# Altium project Goldstrike1_Rev01.PrjPCB (part 2 of 4)

## Sheet GS_01_Core.SchDoc: Title
size A3; Date: Date; CompanyName: Integrated Micro-Electronics Bulgaria; Organization: Design & Development Department; Address1: Drawing Type; Address2: Address 1; Address3: Address 2; Address4: Address 3; DocumentNumber: 730xxx; Revision: 01; SheetNumber: 1; SheetTotal: 1; PageSetup: Record=PageOptions|CenterHorizontal=True|CenterVertical=True|PrintScale=0.70|XCorrection=1.00|YCorrection=1.00|PrintKind=2|BorderSize=5000000|LeftOffset=0|BottomOffset=0|Orientation=2|PaperLength=1000|PaperWidth=1000|Scale=100|PaperSource=7|PrintQuality=-4|MediaType=1|DitherType=10|PaperKind=A4|PrintScaleMode=1; SheetSize: A3; Time: Time; ModifiedDate: Mod. Date
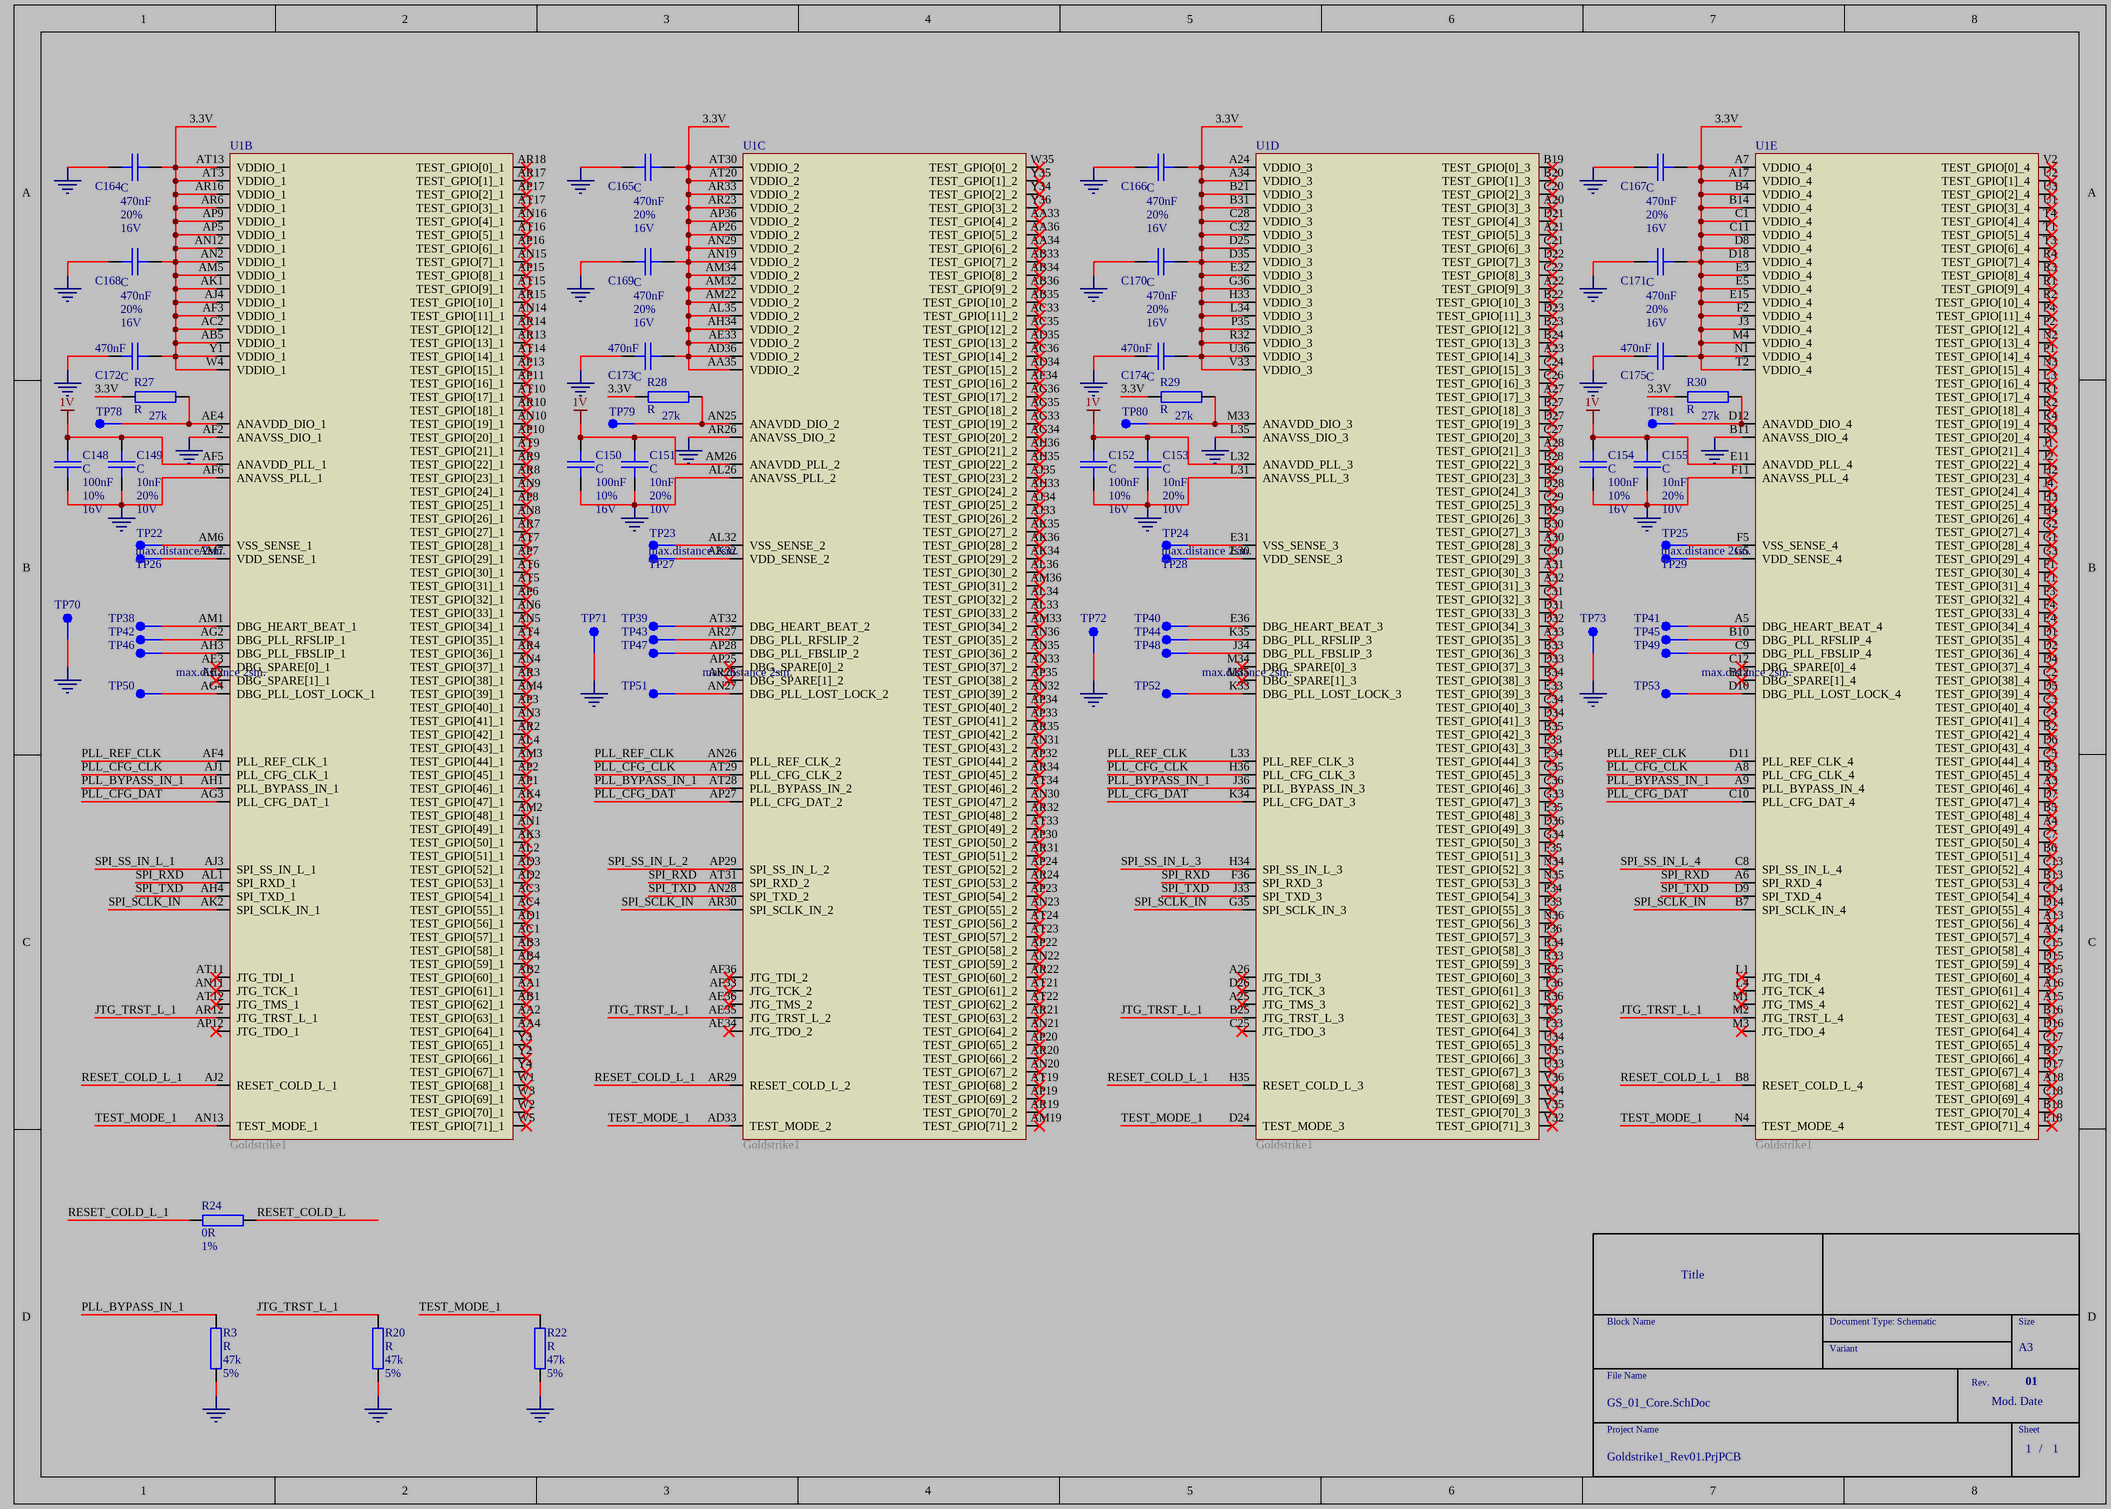
[diagram p2: GS_01_Core.SchDoc]

### Parts
C148  C  DB_VALUE: 100nF  DB_TOLERANCE: 10%  DB_VOLTAGE: 16V  [SMD_0603_CAPC1608X95N]
C149  C  DB_VALUE: 10nF  DB_TOLERANCE: 20%  DB_VOLTAGE: 10V  [SMD_0603_CAPC1608X95N]
C150  C  DB_VALUE: 100nF  DB_TOLERANCE: 10%  DB_VOLTAGE: 16V  [SMD_0603_CAPC1608X95N]
C151  C  DB_VALUE: 10nF  DB_TOLERANCE: 20%  DB_VOLTAGE: 10V  [SMD_0603_CAPC1608X95N]
C152  C  DB_VALUE: 100nF  DB_TOLERANCE: 10%  DB_VOLTAGE: 16V  [SMD_0603_CAPC1608X95N]
C153  C  DB_VALUE: 10nF  DB_TOLERANCE: 20%  DB_VOLTAGE: 10V  [SMD_0603_CAPC1608X95N]
C154  C  DB_VALUE: 100nF  DB_TOLERANCE: 10%  DB_VOLTAGE: 16V  [SMD_0603_CAPC1608X95N]
C155  C  DB_VALUE: 10nF  DB_TOLERANCE: 20%  DB_VOLTAGE: 10V  [SMD_0603_CAPC1608X95N]
C164  C  DB_VALUE: 470nF  DB_TOLERANCE: 20%  DB_VOLTAGE: 16V  [SMD_0603_CAPC1608X95N]
C165  C  DB_VALUE: 470nF  DB_TOLERANCE: 20%  DB_VOLTAGE: 16V  [SMD_0603_CAPC1608X95N]
C166  C  DB_VALUE: 470nF  DB_TOLERANCE: 20%  DB_VOLTAGE: 16V  [SMD_0603_CAPC1608X95N]
C167  C  DB_VALUE: 470nF  DB_TOLERANCE: 20%  DB_VOLTAGE: 16V  [SMD_0603_CAPC1608X95N]
C168  C  DB_VALUE: 470nF  DB_TOLERANCE: 20%  DB_VOLTAGE: 16V  [SMD_0603_CAPC1608X95N]
C169  C  DB_VALUE: 470nF  DB_TOLERANCE: 20%  DB_VOLTAGE: 16V  [SMD_0603_CAPC1608X95N]
C170  C  DB_VALUE: 470nF  DB_TOLERANCE: 20%  DB_VOLTAGE: 16V  [SMD_0603_CAPC1608X95N]
C171  C  DB_VALUE: 470nF  DB_TOLERANCE: 20%  DB_VOLTAGE: 16V  [SMD_0603_CAPC1608X95N]
C172  C  DB_VALUE: 470nF  [SMD_0603_CAPC1608X95N]
C173  C  DB_VALUE: 470nF  [SMD_0603_CAPC1608X95N]
C174  C  DB_VALUE: 470nF  [SMD_0603_CAPC1608X95N]
C175  C  DB_VALUE: 470nF  [SMD_0603_CAPC1608X95N]
R3  R  DB_VALUE: 47k  DB_TOLERANCE: 5%  [SMD_0603_RESC1608X55N]
R20  R  DB_VALUE: 47k  DB_TOLERANCE: 5%  [SMD_0603_RESC1608X55N]
R22  R  DB_VALUE: 47k  DB_TOLERANCE: 5%  [SMD_0603_RESC1608X55N]
R24  DB_VALUE: 0R  DB_TOLERANCE: 1%  [SMD_0603_RESC1608X55N]  (hidden comment: R)
R27  R  DB_VALUE: 27k  [SMD_0603_RESC1608X55N]
R28  R  DB_VALUE: 27k  [SMD_0603_RESC1608X55N]
R29  R  DB_VALUE: 27k  [SMD_0603_RESC1608X55N]
R30  R  DB_VALUE: 27k  [SMD_0603_RESC1608X55N]
TP22  TEST_POINT_1  [SMD_TP_100-254]  (value not drawn)
TP23  TEST_POINT_1  [SMD_TP_100-254]  (value not drawn)
TP24  TEST_POINT_1  [SMD_TP_100-254]  (value not drawn)
TP25  TEST_POINT_1  [SMD_TP_100-254]  (value not drawn)
TP26  TEST_POINT_1  [SMD_TP_100-254]  (value not drawn)
TP27  TEST_POINT_1  [SMD_TP_100-254]  (value not drawn)
TP28  TEST_POINT_1  [SMD_TP_100-254]  (value not drawn)
TP29  TEST_POINT_1  [SMD_TP_100-254]  (value not drawn)
TP38  TEST_POINT_1  [SMD_TP_100-254]  (value not drawn)
TP39  TEST_POINT_1  [SMD_TP_100-254]  (value not drawn)
TP40  TEST_POINT_1  [SMD_TP_100-254]  (value not drawn)
TP41  TEST_POINT_1  [SMD_TP_100-254]  (value not drawn)
TP42  TEST_POINT_1  [SMD_TP_100-254]  (value not drawn)
TP43  TEST_POINT_1  [SMD_TP_100-254]  (value not drawn)
TP44  TEST_POINT_1  [SMD_TP_100-254]  (value not drawn)
TP45  TEST_POINT_1  [SMD_TP_100-254]  (value not drawn)
TP46  TEST_POINT_1  [SMD_TP_100-254]  (value not drawn)
TP47  TEST_POINT_1  [SMD_TP_100-254]  (value not drawn)
TP48  TEST_POINT_1  [SMD_TP_100-254]  (value not drawn)
TP49  TEST_POINT_1  [SMD_TP_100-254]  (value not drawn)
TP50  TEST_POINT_1  [SMD_TP_100-254]  (value not drawn)
TP51  TEST_POINT_1  [SMD_TP_100-254]  (value not drawn)
TP52  TEST_POINT_1  [SMD_TP_100-254]  (value not drawn)
TP53  TEST_POINT_1  [SMD_TP_100-254]  (value not drawn)
TP70  TEST_POINT_1  [SMD_TP_100-254]  (value not drawn)
TP71  TEST_POINT_1  [SMD_TP_100-254]  (value not drawn)
TP72  TEST_POINT_1  [SMD_TP_100-254]  (value not drawn)
TP73  TEST_POINT_1  [SMD_TP_100-254]  (value not drawn)
TP78  TEST_POINT_1  [SMD_TP_100-254]  (value not drawn)
TP79  TEST_POINT_1  [SMD_TP_100-254]  (value not drawn)
TP80  TEST_POINT_1  [SMD_TP_100-254]  (value not drawn)
TP81  TEST_POINT_1  [SMD_TP_100-254]  (value not drawn)
U1  Goldstrike1  (parts B,C,D,E of 5)

### Nets
1V: C148.1 C149.1 C150.1 C151.1 C152.1 C153.1 C154.1 C155.1 U1.AF5(ANAVDD_PLL_1) U1.AM26(ANAVDD_PLL_2) U1.E11(ANAVDD_PLL_4) U1.L32(ANAVDD_PLL_3)
GND: C148.2 C149.2 C150.2 C151.2 C152.2 C153.2 C154.2 C155.2 C164.1 C165.1 C166.1 C167.1 C168.1 C169.1 C170.1 C171.1 C172.1 C173.1 C174.1 C175.1 R3.2 R20.2 R22.2 TP70.1 TP71.1 TP72.1 TP73.1 U1.AF2(ANAVSS_DIO_1) U1.AF6(ANAVSS_PLL_1) U1.AL26(ANAVSS_PLL_2) U1.AR26(ANAVSS_DIO_2) U1.B11(ANAVSS_DIO_4) U1.F11(ANAVSS_PLL_4) U1.L31(ANAVSS_PLL_3) U1.L35(ANAVSS_DIO_3)
3.3V: C164.2 C165.2 C166.2 C167.2 C168.2 C169.2 C170.2 C171.2 C172.2 C173.2 C174.2 C175.2 R27.1 R28.1 R29.1 R30.1 U1.A7(VDDIO_4) U1.A17(VDDIO_4) U1.A24(VDDIO_3) U1.A34(VDDIO_3) U1.AA35(VDDIO_2) U1.AB5(VDDIO_1) U1.AC2(VDDIO_1) U1.AD36(VDDIO_2) U1.AE33(VDDIO_2) U1.AF3(VDDIO_1) U1.AH34(VDDIO_2) U1.AJ4(VDDIO_1) U1.AK1(VDDIO_1) U1.AL35(VDDIO_2) U1.AM5(VDDIO_1) U1.AM22(VDDIO_2) U1.AM32(VDDIO_2) U1.AM34(VDDIO_2) U1.AN2(VDDIO_1) U1.AN12(VDDIO_1) U1.AN19(VDDIO_2) U1.AN29(VDDIO_2) U1.AP5(VDDIO_1) U1.AP9(VDDIO_1) U1.AP26(VDDIO_2) U1.AP36(VDDIO_2) U1.AR6(VDDIO_1) U1.AR16(VDDIO_1) U1.AR23(VDDIO_2) U1.AR33(VDDIO_2) U1.AT3(VDDIO_1) U1.AT13(VDDIO_1) U1.AT20(VDDIO_2) U1.AT30(VDDIO_2) U1.B4(VDDIO_4) U1.B14(VDDIO_4) U1.B21(VDDIO_3) U1.B31(VDDIO_3) U1.C1(VDDIO_4) U1.C11(VDDIO_4) U1.C28(VDDIO_3) U1.C32(VDDIO_3) U1.D8(VDDIO_4) U1.D18(VDDIO_4) U1.D25(VDDIO_3) U1.D35(VDDIO_3) U1.E3(VDDIO_4) U1.E5(VDDIO_4) U1.E15(VDDIO_4) U1.E32(VDDIO_3) U1.F2(VDDIO_4) U1.G36(VDDIO_3) U1.H33(VDDIO_3) U1.J3(VDDIO_4) U1.L34(VDDIO_3) U1.M4(VDDIO_4) U1.N1(VDDIO_4) U1.P35(VDDIO_3) U1.R32(VDDIO_3) U1.T2(VDDIO_4) U1.U36(VDDIO_3) U1.V33(VDDIO_3) U1.W4(VDDIO_1) U1.Y1(VDDIO_1)
JTG_TRST_L_1: R20.1 U1.AE35(JTG_TRST_L_2) U1.AR12(JTG_TRST_L_1) U1.B25(JTG_TRST_L_3) U1.M2(JTG_TRST_L_4)
PLL_BYPASS_IN_1: R3.1 U1.A9(PLL_BYPASS_IN_4) U1.AH1(PLL_BYPASS_IN_1) U1.AT28(PLL_BYPASS_IN_2) U1.J36(PLL_BYPASS_IN_3)
PLL_CFG_CLK: U1.A8(PLL_CFG_CLK_4) U1.AJ1(PLL_CFG_CLK_1) U1.AT29(PLL_CFG_CLK_2) U1.H36(PLL_CFG_CLK_3)
PLL_CFG_DAT: U1.AG3(PLL_CFG_DAT_1) U1.AP27(PLL_CFG_DAT_2) U1.C10(PLL_CFG_DAT_4) U1.K34(PLL_CFG_DAT_3)
PLL_REF_CLK: U1.AF4(PLL_REF_CLK_1) U1.AN26(PLL_REF_CLK_2) U1.D11(PLL_REF_CLK_4) U1.L33(PLL_REF_CLK_3)
RESET_COLD_L: R24.1
RESET_COLD_L_1: R24.2 U1.AJ2(RESET_COLD_L_1) U1.AR29(RESET_COLD_L_2) U1.B8(RESET_COLD_L_4) U1.H35(RESET_COLD_L_3)
SPI_RXD: U1.A6(SPI_RXD_4) U1.AL1(SPI_RXD_1) U1.AT31(SPI_RXD_2) U1.F36(SPI_RXD_3)
SPI_SCLK_IN: U1.AK2(SPI_SCLK_IN_1) U1.AR30(SPI_SCLK_IN_2) U1.B7(SPI_SCLK_IN_4) U1.G35(SPI_SCLK_IN_3)
SPI_SS_IN_L_1: U1.AJ3(SPI_SS_IN_L_1)
SPI_SS_IN_L_2: U1.AP29(SPI_SS_IN_L_2)
SPI_SS_IN_L_3: U1.H34(SPI_SS_IN_L_3)
SPI_SS_IN_L_4: U1.C8(SPI_SS_IN_L_4)
SPI_TXD: U1.AH4(SPI_TXD_1) U1.AN28(SPI_TXD_2) U1.D9(SPI_TXD_4) U1.J33(SPI_TXD_3)
TEST_MODE_1: R22.1 U1.AD33(TEST_MODE_2) U1.AN13(TEST_MODE_1) U1.D24(TEST_MODE_3) U1.N4(TEST_MODE_4)
NetR27_2: R27.2 TP78.1 U1.AE4(ANAVDD_DIO_1)
NetR28_2: R28.2 TP79.1 U1.AN25(ANAVDD_DIO_2)
NetR29_2: R29.2 TP80.1 U1.M33(ANAVDD_DIO_3)
NetR30_2: R30.2 TP81.1 U1.D12(ANAVDD_DIO_4)
NetTP22_1: TP22.1 U1.AM6(VSS_SENSE_1)
NetTP23_1: TP23.1 U1.AL32(VSS_SENSE_2)
NetTP24_1: TP24.1 U1.E31(VSS_SENSE_3)
NetTP25_1: TP25.1 U1.F5(VSS_SENSE_4)
NetTP26_1: TP26.1 U1.AM7(VDD_SENSE_1)
NetTP27_1: TP27.1 U1.AK32(VDD_SENSE_2)
NetTP28_1: TP28.1 U1.E30(VDD_SENSE_3)
NetTP29_1: TP29.1 U1.G5(VDD_SENSE_4)
NetTP38_1: TP38.1 U1.AM1(DBG_HEART_BEAT_1)
NetTP39_1: TP39.1 U1.AT32(DBG_HEART_BEAT_2)
NetTP40_1: TP40.1 U1.E36(DBG_HEART_BEAT_3)
NetTP41_1: TP41.1 U1.A5(DBG_HEART_BEAT_4)
NetTP42_1: TP42.1 U1.AG2(DBG_PLL_RFSLIP_1)
NetTP43_1: TP43.1 U1.AR27(DBG_PLL_RFSLIP_2)
NetTP44_1: TP44.1 U1.K35(DBG_PLL_RFSLIP_3)
NetTP45_1: TP45.1 U1.B10(DBG_PLL_RFSLIP_4)
NetTP46_1: TP46.1 U1.AH3(DBG_PLL_FBSLIP_1)
NetTP47_1: TP47.1 U1.AP28(DBG_PLL_FBSLIP_2)
NetTP48_1: TP48.1 U1.J34(DBG_PLL_FBSLIP_3)
NetTP49_1: TP49.1 U1.C9(DBG_PLL_FBSLIP_4)
NetTP50_1: TP50.1 U1.AG4(DBG_PLL_LOST_LOCK_1)
NetTP51_1: TP51.1 U1.AN27(DBG_PLL_LOST_LOCK_2)
NetTP52_1: TP52.1 U1.K33(DBG_PLL_LOST_LOCK_3)
NetTP53_1: TP53.1 U1.D10(DBG_PLL_LOST_LOCK_4)

Not connected (* = marked no-connect by the designer): U1 A3(TEST_GPIO[46]_4)* A4(TEST_GPIO[49]_4)* A13(TEST_GPIO[56]_4)* A14(TEST_GPIO[57]_4)* A15(TEST_GPIO[62]_4)* A16(TEST_GPIO[61]_4)* A18(TEST_GPIO[68]_4)* A20(TEST_GPIO[3]_3)* A21(TEST_GPIO[5]_3)* A22(TEST_GPIO[9]_3)* A23(TEST_GPIO[14]_3)* A25(JTG_TMS_3)* A26(JTG_TDI_3)* A27(TEST_GPIO[17]_3)* A28(TEST_GPIO[21]_3)* A30(TEST_GPIO[28]_3)* A31(TEST_GPIO[30]_3)* A32(TEST_GPIO[31]_3)* A33(TEST_GPIO[35]_3)* AA1(TEST_GPIO[61]_1)* AA2(TEST_GPIO[63]_1)* AA4(TEST_GPIO[64]_1)* AA33(TEST_GPIO[4]_2)* AA34(TEST_GPIO[6]_2)* AA36(TEST_GPIO[5]_2)* AB1(TEST_GPIO[62]_1)* AB2(TEST_GPIO[60]_1)* AB3(TEST_GPIO[58]_1)* AB4(TEST_GPIO[59]_1)* AB33(TEST_GPIO[7]_2)* AB34(TEST_GPIO[8]_2)* AB35(TEST_GPIO[10]_2)* AB36(TEST_GPIO[9]_2)* AC1(TEST_GPIO[57]_1)* AC3(TEST_GPIO[54]_1)* AC4(TEST_GPIO[55]_1)* AC33(TEST_GPIO[11]_2)* AC35(TEST_GPIO[12]_2)* AC36(TEST_GPIO[14]_2)* AD1(TEST_GPIO[56]_1)* AD2(TEST_GPIO[53]_1)* AD3(TEST_GPIO[52]_1)* AD34(TEST_GPIO[15]_2)* AD35(TEST_GPIO[13]_2)* AE2(DBG_SPARE[1]_1)* AE3(DBG_SPARE[0]_1)* AE34(JTG_TDO_2)* AE36(JTG_TMS_2)* AF33(JTG_TCK_2)* AF34(TEST_GPIO[16]_2)* AF36(JTG_TDI_2)* AG33(TEST_GPIO[19]_2)* AG34(TEST_GPIO[20]_2)* AG35(TEST_GPIO[18]_2)* AG36(TEST_GPIO[17]_2)* AH33(TEST_GPIO[24]_2)* AH35(TEST_GPIO[22]_2)* AH36(TEST_GPIO[21]_2)* AJ33(TEST_GPIO[26]_2)* AJ34(TEST_GPIO[25]_2)* AJ35(TEST_GPIO[23]_2)* AK3(TEST_GPIO[50]_1)* AK4(TEST_GPIO[47]_1)* AK34(TEST_GPIO[29]_2)* AK35(TEST_GPIO[27]_2)* AK36(TEST_GPIO[28]_2)* AL2(TEST_GPIO[51]_1)* AL4(TEST_GPIO[43]_1)* AL33(TEST_GPIO[33]_2)* AL34(TEST_GPIO[32]_2)* AL36(TEST_GPIO[30]_2)* AM2(TEST_GPIO[48]_1)* AM3(TEST_GPIO[44]_1)* AM4(TEST_GPIO[39]_1)* AM19(TEST_GPIO[71]_2)* AM33(TEST_GPIO[34]_2)* AM36(TEST_GPIO[31]_2)* AN1(TEST_GPIO[49]_1)* AN3(TEST_GPIO[41]_1)* AN4(TEST_GPIO[37]_1)* AN5(TEST_GPIO[34]_1)* AN6(TEST_GPIO[33]_1)* AN8(TEST_GPIO[26]_1)* AN9(TEST_GPIO[24]_1)* AN10(TEST_GPIO[19]_1)* AN11(JTG_TCK_1)* AN14(TEST_GPIO[11]_1)* AN15(TEST_GPIO[7]_1)* AN16(TEST_GPIO[4]_1)* AN20(TEST_GPIO[67]_2)* AN21(TEST_GPIO[64]_2)* AN22(TEST_GPIO[59]_2)* AN23(TEST_GPIO[55]_2)* AN30(TEST_GPIO[47]_2)* AN31(TEST_GPIO[43]_2)* AN32(TEST_GPIO[39]_2)* AN33(TEST_GPIO[37]_2)* AN35(TEST_GPIO[36]_2)* AN36(TEST_GPIO[35]_2)* AP1(TEST_GPIO[46]_1)* AP2(TEST_GPIO[45]_1)* AP3(TEST_GPIO[40]_1)* AP6(TEST_GPIO[32]_1)* AP7(TEST_GPIO[29]_1)* AP8(TEST_GPIO[25]_1)* AP10(TEST_GPIO[20]_1)* AP11(TEST_GPIO[16]_1)* AP12(JTG_TDO_1)* AP13(TEST_GPIO[15]_1)* AP15(TEST_GPIO[8]_1)* AP16(TEST_GPIO[6]_1)* AP17(TEST_GPIO[2]_1)* AP19(TEST_GPIO[69]_2)* AP20(TEST_GPIO[65]_2)* AP22(TEST_GPIO[58]_2)* AP23(TEST_GPIO[54]_2)* AP24(TEST_GPIO[52]_2)* AP25(DBG_SPARE[0]_2)* AP30(TEST_GPIO[50]_2)* AP32(TEST_GPIO[44]_2)* AP33(TEST_GPIO[41]_2)* AP34(TEST_GPIO[40]_2)* AP35(TEST_GPIO[38]_2)* AR2(TEST_GPIO[42]_1)* AR3(TEST_GPIO[38]_1)* AR4(TEST_GPIO[36]_1)* AR7(TEST_GPIO[27]_1)* AR8(TEST_GPIO[23]_1)* AR9(TEST_GPIO[22]_1)* AR10(TEST_GPIO[18]_1)* AR13(TEST_GPIO[13]_1)* AR14(TEST_GPIO[12]_1)* AR15(TEST_GPIO[10]_1)* AR17(TEST_GPIO[1]_1)* AR18(TEST_GPIO[0]_1)* AR19(TEST_GPIO[70]_2)* AR20(TEST_GPIO[66]_2)* AR21(TEST_GPIO[63]_2)* AR22(TEST_GPIO[60]_2)* AR24(TEST_GPIO[53]_2)* AR25(DBG_SPARE[1]_2)* AR31(TEST_GPIO[51]_2)* AR32(TEST_GPIO[48]_2)* AR34(TEST_GPIO[45]_2)* AR35(TEST_GPIO[42]_2)* AT4(TEST_GPIO[35]_1)* AT5(TEST_GPIO[31]_1)* AT6(TEST_GPIO[30]_1)* AT7(TEST_GPIO[28]_1)* AT9(TEST_GPIO[21]_1)* AT10(TEST_GPIO[17]_1)* AT11(JTG_TDI_1)* AT12(JTG_TMS_1)* AT14(TEST_GPIO[14]_1)* AT15(TEST_GPIO[9]_1)* AT16(TEST_GPIO[5]_1)* AT17(TEST_GPIO[3]_1)* AT19(TEST_GPIO[68]_2)* AT21(TEST_GPIO[61]_2)* AT22(TEST_GPIO[62]_2)* AT23(TEST_GPIO[57]_2)* AT24(TEST_GPIO[56]_2)* AT33(TEST_GPIO[49]_2)* AT34(TEST_GPIO[46]_2)* B2(TEST_GPIO[42]_4)* B3(TEST_GPIO[45]_4)* B5(TEST_GPIO[48]_4)* B6(TEST_GPIO[51]_4)* B12(DBG_SPARE[1]_4)* B13(TEST_GPIO[53]_4)* B15(TEST_GPIO[60]_4)* B16(TEST_GPIO[63]_4)* B17(TEST_GPIO[66]_4)* B18(TEST_GPIO[70]_4)* B19(TEST_GPIO[0]_3)* B20(TEST_GPIO[1]_3)* B22(TEST_GPIO[10]_3)* B23(TEST_GPIO[12]_3)* B24(TEST_GPIO[13]_3)* B27(TEST_GPIO[18]_3)* B28(TEST_GPIO[22]_3)* B29(TEST_GPIO[23]_3)* B30(TEST_GPIO[27]_3)* B33(TEST_GPIO[36]_3)* B34(TEST_GPIO[38]_3)* B35(TEST_GPIO[42]_3)* C2(TEST_GPIO[38]_4)* C3(TEST_GPIO[40]_4)* C4(TEST_GPIO[41]_4)* C5(TEST_GPIO[44]_4)* C7(TEST_GPIO[50]_4)* C12(DBG_SPARE[0]_4)* C13(TEST_GPIO[52]_4)* C14(TEST_GPIO[54]_4)* C15(TEST_GPIO[58]_4)* C17(TEST_GPIO[65]_4)* C18(TEST_GPIO[69]_4)* C20(TEST_GPIO[2]_3)* C21(TEST_GPIO[6]_3)* C22(TEST_GPIO[8]_3)* C24(TEST_GPIO[15]_3)* C25(JTG_TDO_3)* C26(TEST_GPIO[16]_3)* C27(TEST_GPIO[20]_3)* C29(TEST_GPIO[25]_3)* C30(TEST_GPIO[29]_3)* C31(TEST_GPIO[32]_3)* C34(TEST_GPIO[40]_3)* C35(TEST_GPIO[45]_3)* C36(TEST_GPIO[46]_3)* D1(TEST_GPIO[35]_4)* D2(TEST_GPIO[36]_4)* D4(TEST_GPIO[37]_4)* D5(TEST_GPIO[39]_4)* D6(TEST_GPIO[43]_4)* D7(TEST_GPIO[47]_4)* D14(TEST_GPIO[55]_4)* D15(TEST_GPIO[59]_4)* D16(TEST_GPIO[64]_4)* D17(TEST_GPIO[67]_4)* D21(TEST_GPIO[4]_3)* D22(TEST_GPIO[7]_3)* D23(TEST_GPIO[11]_3)* D26(JTG_TCK_3)* D27(TEST_GPIO[19]_3)* D28(TEST_GPIO[24]_3)* D29(TEST_GPIO[26]_3)* D31(TEST_GPIO[33]_3)* D32(TEST_GPIO[34]_3)* D33(TEST_GPIO[37]_3)* D34(TEST_GPIO[41]_3)* D36(TEST_GPIO[49]_3)* E1(TEST_GPIO[31]_4)* E4(TEST_GPIO[34]_4)* E18(TEST_GPIO[71]_4)* E33(TEST_GPIO[39]_3)* E34(TEST_GPIO[44]_3)* E35(TEST_GPIO[48]_3)* F1(TEST_GPIO[30]_4)* F3(TEST_GPIO[32]_4)* F4(TEST_GPIO[33]_4)* F33(TEST_GPIO[43]_3)* F35(TEST_GPIO[51]_3)* G1(TEST_GPIO[28]_4)* G2(TEST_GPIO[27]_4)* G3(TEST_GPIO[29]_4)* G33(TEST_GPIO[47]_3)* G34(TEST_GPIO[50]_3)* H2(TEST_GPIO[23]_4)* H3(TEST_GPIO[25]_4)* H4(TEST_GPIO[26]_4)* J1(TEST_GPIO[21]_4)* J2(TEST_GPIO[22]_4)* J4(TEST_GPIO[24]_4)* K1(TEST_GPIO[17]_4)* K2(TEST_GPIO[18]_4)* K3(TEST_GPIO[20]_4)* K4(TEST_GPIO[19]_4)* L1(JTG_TDI_4)* L3(TEST_GPIO[16]_4)* L4(JTG_TCK_4)* M1(JTG_TMS_4)* M3(JTG_TDO_4)* M34(DBG_SPARE[0]_3)* M35(DBG_SPARE[1]_3)* N2(TEST_GPIO[13]_4)* N3(TEST_GPIO[15]_4)* N34(TEST_GPIO[52]_3)* N35(TEST_GPIO[53]_3)* N36(TEST_GPIO[56]_3)* P1(TEST_GPIO[14]_4)* P2(TEST_GPIO[12]_4)* P4(TEST_GPIO[11]_4)* P33(TEST_GPIO[55]_3)* P34(TEST_GPIO[54]_3)* P36(TEST_GPIO[57]_3)* R1(TEST_GPIO[9]_4)* R2(TEST_GPIO[10]_4)* R3(TEST_GPIO[8]_4)* R4(TEST_GPIO[7]_4)* R33(TEST_GPIO[59]_3)* R34(TEST_GPIO[58]_3)* R35(TEST_GPIO[60]_3)* R36(TEST_GPIO[62]_3)* T1(TEST_GPIO[5]_4)* T3(TEST_GPIO[6]_4)* T4(TEST_GPIO[4]_4)* T33(TEST_GPIO[64]_3)* T35(TEST_GPIO[63]_3)* T36(TEST_GPIO[61]_3)* U1(TEST_GPIO[3]_4)* U2(TEST_GPIO[1]_4)* U3(TEST_GPIO[2]_4)* U33(TEST_GPIO[67]_3)* U34(TEST_GPIO[65]_3)* U35(TEST_GPIO[66]_3)* V2(TEST_GPIO[0]_4)* V32(TEST_GPIO[71]_3)* V34(TEST_GPIO[69]_3)* V35(TEST_GPIO[70]_3)* V36(TEST_GPIO[68]_3)* W1(TEST_GPIO[68]_1)* W2(TEST_GPIO[70]_1)* W3(TEST_GPIO[69]_1)* W5(TEST_GPIO[71]_1)* W35(TEST_GPIO[0]_2)* Y2(TEST_GPIO[66]_1)* Y3(TEST_GPIO[65]_1)* Y4(TEST_GPIO[67]_1)* Y34(TEST_GPIO[2]_2)* Y35(TEST_GPIO[1]_2)* Y36(TEST_GPIO[3]_2)*

### Notes on the sheet
- max.distance 2sm.
- Block Name
- Document Type: Schematic
- Size
- File Name
- Variant
- Rev.
- Project Name
- Sheet
- /

### Library data of the parts
C148 C150 C152 C154 = CAP000047357: NOTE: <NOTE>; DB_PART_NUMBER: CAP000047357
C149 C151 C153 C155 = CAP000038821: NOTE: <NOTE>; DB_PART_NUMBER: CAP000038821
C164-C171 = CAP000023179: DB_PART_TYPE: Ceramic_SMD\Open_Mode_X7R; DB_MANUFACTURER_PART: KEMET    C0603F474M4RAC; NOTE: <NOTE>; DB_T_RANGE: -55 to 125; DB_PACKAGE: 0603; DB_DESCRIPTION: C X7R 470nF 20% 16V 0603; DB_STATUS: NEW; DB_PART_NUMBER: CAP000023179; DB_PCB_DEVICE: SMD_0603_CAPC1608X95N; DB_APPROVED_ON: 09.10.2010; DB_DATASHEET: http://john.epiqdesign.com/projects/CIS_Datasheets/F3102_CE_Kemet.pdf?rev=92&sc=0
C172-C175 = CAP000023179: DB_PART_TYPE: Ceramic_SMD\Open_Mode_X7R; DB_MANUFACTURER_PART: KEMET    C0603F474M4RAC; NOTE: <NOTE>; DB_TOLERANCE: 20%; DB_VOLTAGE: 16V; DB_T_RANGE: -55 to 125; DB_PACKAGE: 0603; DB_DESCRIPTION: C X7R 470nF 20% 16V 0603; DB_STATUS: NEW; DB_PART_NUMBER: CAP000023179; DB_PCB_DEVICE: SMD_0603_CAPC1608X95N; DB_APPROVED_ON: 09.10.2010; DB_DATASHEET: http://john.epiqdesign.com/projects/CIS_Datasheets/F3102_CE_Kemet.pdf?rev=92&sc=0
R3 R20 R22 = RES000006462: DB_PART_TYPE: SMD; DB_MANUFACTURER_PART: YAGEO    RC0603JR-0747K; NOTE: <NOTE>; DB_T_RANGE: -55 to 155; DB_POWER: 1/10W; DB_PACKAGE: 0603; DB_DESCRIPTION: R SMD 47K 5% 1/10W 0603; DB_PRICE: 0.000364; DB_MOQ: 5000; DB_STATUS: NEW; R_BDS: R; DB_PART_NUMBER: RES000006462; DB_PCB_DEVICE: SMD_0603_RESC1608X55N; DB_PRICE_DATE: 2010-12-23; DB_APPROVED_ON: 09.10.2010; DB_DATASHEET: http://john.epiqdesign.com/projects/CIS_Datasheets/PYu-RC0603_51_RoHS_L_4_YAGEO.pdf?rev=138&sc=0
R24 = RES000008926: DB_PART_TYPE: SMD; DB_MANUFACTURER_PART: YAGEO    AC0603FR-070RL; NOTE: <NOTE>; DB_T_RANGE: -55 to 155; DB_POWER: 1/10W; DB_PACKAGE: 0603; DB_DESCRIPTION: R SMD 0R 1% 1/10W 0603; DB_CERTIFIED: AUT; DB_APPROVED_BY: VSN; DB_STATUS: NEW; R_BDS: R; DB_PART_NUMBER: RES000008926; DB_PCB_DEVICE: SMD_0603_RESC1608X55N; DB_APPROVED_ON: 21.05.2013 09:19:53; DB_DATASHEET: http://john.epiqdesign.com/projects/CIS_Datasheets/RES_AC_YAGEO.pdf?rev=263&sc=0
R27-R30 = RES000006456: DB_PART_TYPE: SMD; DB_MANUFACTURER_PART: YAGEO    RC0603JR-0727K; NOTE: <NOTE>; DB_TOLERANCE: 5%; DB_T_RANGE: -55 to 155; DB_POWER: 1/10W; DB_PACKAGE: 0603; DB_DESCRIPTION: R SMD 27K 5% 1/10W 0603; DB_PRICE: 0.000364; DB_MOQ: 5000; DB_STATUS: NEW; R_BDS: R; DB_PART_NUMBER: RES000006456; DB_PCB_DEVICE: SMD_0603_RESC1608X55N; DB_PRICE_DATE: 2010-12-23; DB_APPROVED_ON: 09.10.2010; DB_DATASHEET: http://john.epiqdesign.com/projects/CIS_Datasheets/PYu-RC0603_51_RoHS_L_4_YAGEO.pdf?rev=138&sc=0
TP22-TP29 TP38-TP53 TP70-TP73 TP78-TP81 = TPO000000001: DB_PART_TYPE: Test Point; DB_VALUE: 100_254; DB_DESCRIPTION: Test Point 100_254; DB_STATUS: NEW; DB_PART_NUMBER: TPO000000001; DB_DIAMETER: 100_254; DB_PCB_DEVICE: SMD_TP_100-254; DB_APPROVED_ON: 10.09.2010

## Sheet GS_01_Pow.SchDoc: Title
size A3; Date: Date; CompanyName: Integrated Micro-Electronics Bulgaria; Organization: Design & Development Department; Address1: Drawing Type; Address2: Address 1; Address3: Address 2; Address4: Address 3; DocumentNumber: 730xxx; Revision: 01; SheetNumber: 1; SheetTotal: 1; PageSetup: Record=PageOptions|CenterHorizontal=True|CenterVertical=True|PrintScale=0.70|XCorrection=1.00|YCorrection=1.00|PrintKind=2|BorderSize=5000000|LeftOffset=0|BottomOffset=0|Orientation=2|PaperLength=1000|PaperWidth=1000|Scale=100|PaperSource=7|PrintQuality=-4|MediaType=1|DitherType=10|PaperKind=A4|PrintScaleMode=1; SheetSize: A3; Time: Time; ModifiedDate: Mod. Date
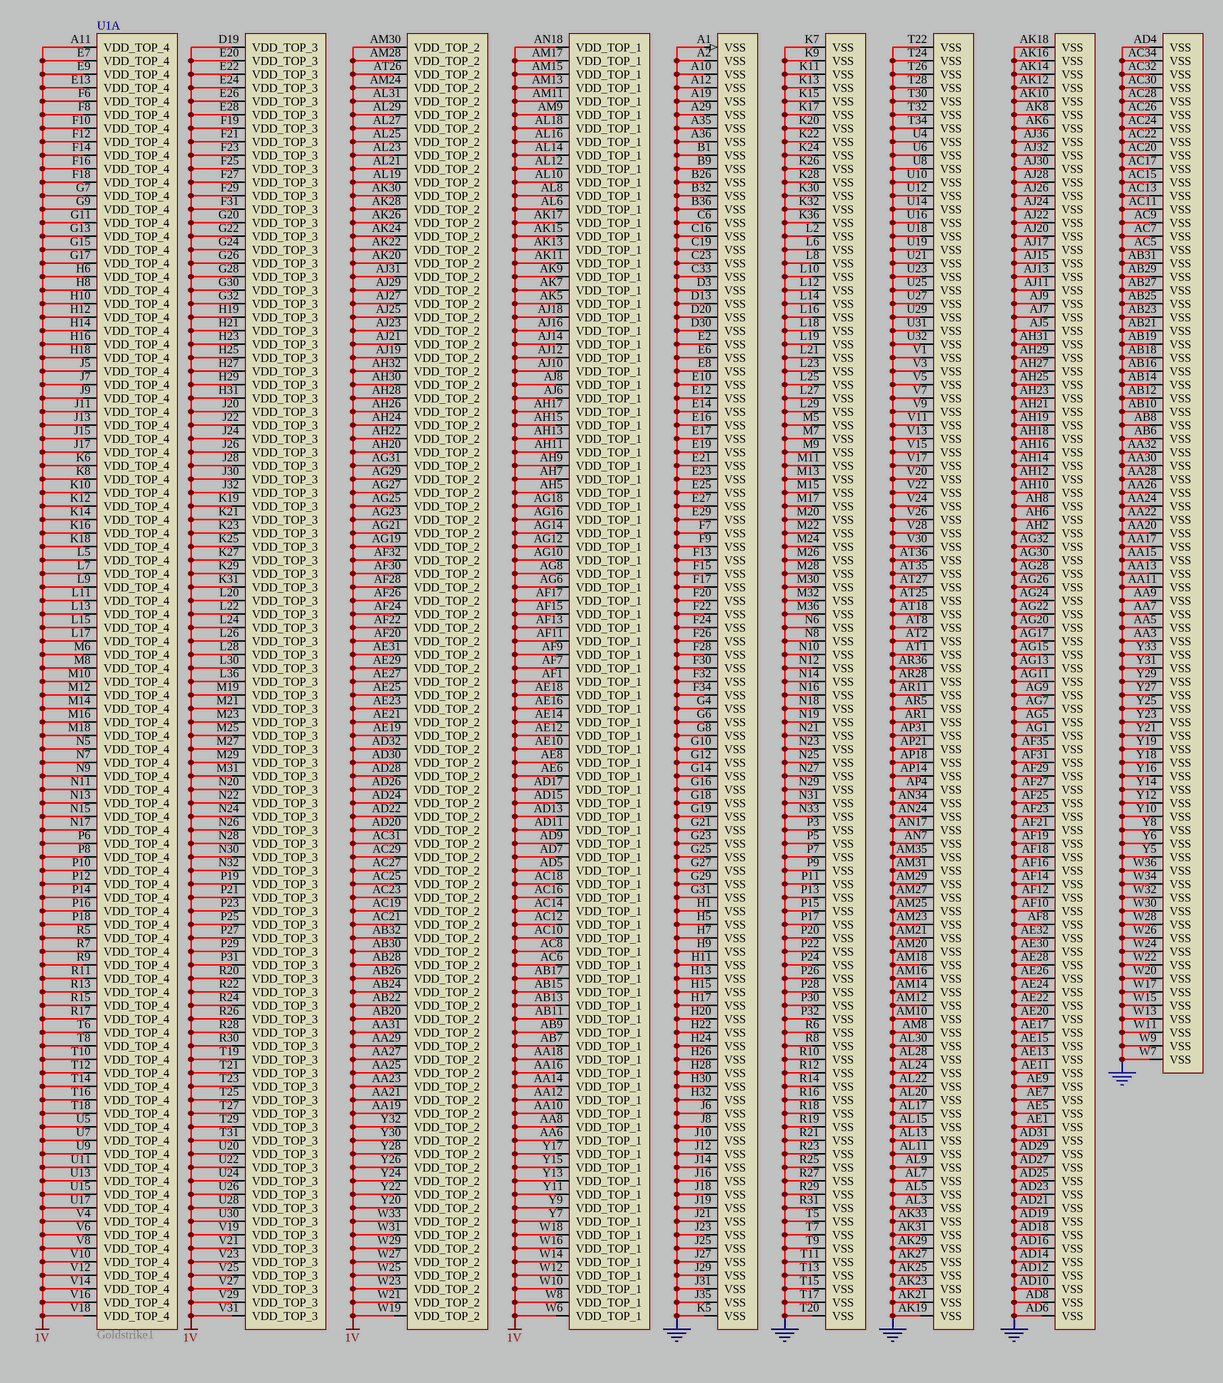
[diagram p3: GS_01_Pow.SchDoc]

### Parts
U1  Goldstrike1  (part A of 5)

### Nets
1V: U1.A11(VDD_TOP_4) U1.AA6(VDD_TOP_1) U1.AA8(VDD_TOP_1) U1.AA10(VDD_TOP_1) U1.AA12(VDD_TOP_1) U1.AA14(VDD_TOP_1) U1.AA16(VDD_TOP_1) U1.AA18(VDD_TOP_1) U1.AA19(VDD_TOP_2) U1.AA21(VDD_TOP_2) U1.AA23(VDD_TOP_2) U1.AA25(VDD_TOP_2) U1.AA27(VDD_TOP_2) U1.AA29(VDD_TOP_2) U1.AA31(VDD_TOP_2) U1.AB7(VDD_TOP_1) U1.AB9(VDD_TOP_1) U1.AB11(VDD_TOP_1) U1.AB13(VDD_TOP_1) U1.AB15(VDD_TOP_1) U1.AB17(VDD_TOP_1) U1.AB20(VDD_TOP_2) U1.AB22(VDD_TOP_2) U1.AB24(VDD_TOP_2) U1.AB26(VDD_TOP_2) U1.AB28(VDD_TOP_2) U1.AB30(VDD_TOP_2) U1.AB32(VDD_TOP_2) U1.AC6(VDD_TOP_1) U1.AC8(VDD_TOP_1) U1.AC10(VDD_TOP_1) U1.AC12(VDD_TOP_1) U1.AC14(VDD_TOP_1) U1.AC16(VDD_TOP_1) U1.AC18(VDD_TOP_1) U1.AC19(VDD_TOP_2) U1.AC21(VDD_TOP_2) U1.AC23(VDD_TOP_2) U1.AC25(VDD_TOP_2) U1.AC27(VDD_TOP_2) U1.AC29(VDD_TOP_2) U1.AC31(VDD_TOP_2) U1.AD5(VDD_TOP_1) U1.AD7(VDD_TOP_1) U1.AD9(VDD_TOP_1) U1.AD11(VDD_TOP_1) U1.AD13(VDD_TOP_1) U1.AD15(VDD_TOP_1) U1.AD17(VDD_TOP_1) U1.AD20(VDD_TOP_2) U1.AD22(VDD_TOP_2) U1.AD24(VDD_TOP_2) U1.AD26(VDD_TOP_2) U1.AD28(VDD_TOP_2) U1.AD30(VDD_TOP_2) U1.AD32(VDD_TOP_2) U1.AE6(VDD_TOP_1) U1.AE8(VDD_TOP_1) U1.AE10(VDD_TOP_1) U1.AE12(VDD_TOP_1) U1.AE14(VDD_TOP_1) U1.AE16(VDD_TOP_1) U1.AE18(VDD_TOP_1) U1.AE19(VDD_TOP_2) U1.AE21(VDD_TOP_2) U1.AE23(VDD_TOP_2) U1.AE25(VDD_TOP_2) U1.AE27(VDD_TOP_2) U1.AE29(VDD_TOP_2) U1.AE31(VDD_TOP_2) U1.AF1(VDD_TOP_1) U1.AF7(VDD_TOP_1) U1.AF9(VDD_TOP_1) U1.AF11(VDD_TOP_1) U1.AF13(VDD_TOP_1) U1.AF15(VDD_TOP_1) U1.AF17(VDD_TOP_1) U1.AF20(VDD_TOP_2) U1.AF22(VDD_TOP_2) U1.AF24(VDD_TOP_2) U1.AF26(VDD_TOP_2) U1.AF28(VDD_TOP_2) U1.AF30(VDD_TOP_2) U1.AF32(VDD_TOP_2) U1.AG6(VDD_TOP_1) U1.AG8(VDD_TOP_1) U1.AG10(VDD_TOP_1) U1.AG12(VDD_TOP_1) U1.AG14(VDD_TOP_1) U1.AG16(VDD_TOP_1) U1.AG18(VDD_TOP_1) U1.AG19(VDD_TOP_2) U1.AG21(VDD_TOP_2) U1.AG23(VDD_TOP_2) U1.AG25(VDD_TOP_2) U1.AG27(VDD_TOP_2) U1.AG29(VDD_TOP_2) U1.AG31(VDD_TOP_2) U1.AH5(VDD_TOP_1) U1.AH7(VDD_TOP_1) U1.AH9(VDD_TOP_1) U1.AH11(VDD_TOP_1) U1.AH13(VDD_TOP_1) U1.AH15(VDD_TOP_1) U1.AH17(VDD_TOP_1) U1.AH20(VDD_TOP_2) U1.AH22(VDD_TOP_2) U1.AH24(VDD_TOP_2) U1.AH26(VDD_TOP_2) U1.AH28(VDD_TOP_2) U1.AH30(VDD_TOP_2) U1.AH32(VDD_TOP_2) U1.AJ6(VDD_TOP_1) U1.AJ8(VDD_TOP_1) U1.AJ10(VDD_TOP_1) U1.AJ12(VDD_TOP_1) U1.AJ14(VDD_TOP_1) U1.AJ16(VDD_TOP_1) U1.AJ18(VDD_TOP_1) U1.AJ19(VDD_TOP_2) U1.AJ21(VDD_TOP_2) U1.AJ23(VDD_TOP_2) U1.AJ25(VDD_TOP_2) U1.AJ27(VDD_TOP_2) U1.AJ29(VDD_TOP_2) U1.AJ31(VDD_TOP_2) U1.AK5(VDD_TOP_1) U1.AK7(VDD_TOP_1) U1.AK9(VDD_TOP_1) U1.AK11(VDD_TOP_1) U1.AK13(VDD_TOP_1) U1.AK15(VDD_TOP_1) U1.AK17(VDD_TOP_1) U1.AK20(VDD_TOP_2) U1.AK22(VDD_TOP_2) U1.AK24(VDD_TOP_2) U1.AK26(VDD_TOP_2) U1.AK28(VDD_TOP_2) U1.AK30(VDD_TOP_2) U1.AL6(VDD_TOP_1) U1.AL8(VDD_TOP_1) U1.AL10(VDD_TOP_1) U1.AL12(VDD_TOP_1) U1.AL14(VDD_TOP_1) U1.AL16(VDD_TOP_1) U1.AL18(VDD_TOP_1) U1.AL19(VDD_TOP_2) U1.AL21(VDD_TOP_2) U1.AL23(VDD_TOP_2) U1.AL25(VDD_TOP_2) U1.AL27(VDD_TOP_2) U1.AL29(VDD_TOP_2) U1.AL31(VDD_TOP_2) U1.AM9(VDD_TOP_1) U1.AM11(VDD_TOP_1) U1.AM13(VDD_TOP_1) U1.AM15(VDD_TOP_1) U1.AM17(VDD_TOP_1) U1.AM24(VDD_TOP_2) U1.AM28(VDD_TOP_2) U1.AM30(VDD_TOP_2) U1.AN18(VDD_TOP_1) U1.AT26(VDD_TOP_2) U1.D19(VDD_TOP_3) U1.E7(VDD_TOP_4) U1.E9(VDD_TOP_4) U1.E13(VDD_TOP_4) U1.E20(VDD_TOP_3) U1.E22(VDD_TOP_3) U1.E24(VDD_TOP_3) U1.E26(VDD_TOP_3) U1.E28(VDD_TOP_3) U1.F6(VDD_TOP_4) U1.F8(VDD_TOP_4) U1.F10(VDD_TOP_4) U1.F12(VDD_TOP_4) U1.F14(VDD_TOP_4) U1.F16(VDD_TOP_4) U1.F18(VDD_TOP_4) U1.F19(VDD_TOP_3) U1.F21(VDD_TOP_3) U1.F23(VDD_TOP_3) U1.F25(VDD_TOP_3) U1.F27(VDD_TOP_3) U1.F29(VDD_TOP_3) U1.F31(VDD_TOP_3) U1.G7(VDD_TOP_4) U1.G9(VDD_TOP_4) U1.G11(VDD_TOP_4) U1.G13(VDD_TOP_4) U1.G15(VDD_TOP_4) U1.G17(VDD_TOP_4) U1.G20(VDD_TOP_3) U1.G22(VDD_TOP_3) U1.G24(VDD_TOP_3) U1.G26(VDD_TOP_3) U1.G28(VDD_TOP_3) U1.G30(VDD_TOP_3) U1.G32(VDD_TOP_3) U1.H6(VDD_TOP_4) U1.H8(VDD_TOP_4) U1.H10(VDD_TOP_4) U1.H12(VDD_TOP_4) U1.H14(VDD_TOP_4) U1.H16(VDD_TOP_4) U1.H18(VDD_TOP_4) U1.H19(VDD_TOP_3) U1.H21(VDD_TOP_3) U1.H23(VDD_TOP_3) U1.H25(VDD_TOP_3) U1.H27(VDD_TOP_3) U1.H29(VDD_TOP_3) U1.H31(VDD_TOP_3) U1.J5(VDD_TOP_4) U1.J7(VDD_TOP_4) U1.J9(VDD_TOP_4) U1.J11(VDD_TOP_4) U1.J13(VDD_TOP_4) U1.J15(VDD_TOP_4) U1.J17(VDD_TOP_4) U1.J20(VDD_TOP_3) U1.J22(VDD_TOP_3) U1.J24(VDD_TOP_3) U1.J26(VDD_TOP_3) U1.J28(VDD_TOP_3) U1.J30(VDD_TOP_3) U1.J32(VDD_TOP_3) U1.K6(VDD_TOP_4) U1.K8(VDD_TOP_4) U1.K10(VDD_TOP_4) U1.K12(VDD_TOP_4) U1.K14(VDD_TOP_4) U1.K16(VDD_TOP_4) U1.K18(VDD_TOP_4) U1.K19(VDD_TOP_3) U1.K21(VDD_TOP_3) U1.K23(VDD_TOP_3) U1.K25(VDD_TOP_3) U1.K27(VDD_TOP_3) U1.K29(VDD_TOP_3) U1.K31(VDD_TOP_3) U1.L5(VDD_TOP_4) U1.L7(VDD_TOP_4) U1.L9(VDD_TOP_4) U1.L11(VDD_TOP_4) U1.L13(VDD_TOP_4) U1.L15(VDD_TOP_4) U1.L17(VDD_TOP_4) U1.L20(VDD_TOP_3) U1.L22(VDD_TOP_3) U1.L24(VDD_TOP_3) U1.L26(VDD_TOP_3) U1.L28(VDD_TOP_3) U1.L30(VDD_TOP_3) U1.L36(VDD_TOP_3) U1.M6(VDD_TOP_4) U1.M8(VDD_TOP_4) U1.M10(VDD_TOP_4) U1.M12(VDD_TOP_4) U1.M14(VDD_TOP_4) U1.M16(VDD_TOP_4) U1.M18(VDD_TOP_4) U1.M19(VDD_TOP_3) U1.M21(VDD_TOP_3) U1.M23(VDD_TOP_3) U1.M25(VDD_TOP_3) U1.M27(VDD_TOP_3) U1.M29(VDD_TOP_3) U1.M31(VDD_TOP_3) U1.N5(VDD_TOP_4) U1.N7(VDD_TOP_4) U1.N9(VDD_TOP_4) U1.N11(VDD_TOP_4) U1.N13(VDD_TOP_4) U1.N15(VDD_TOP_4) U1.N17(VDD_TOP_4) U1.N20(VDD_TOP_3) U1.N22(VDD_TOP_3) U1.N24(VDD_TOP_3) U1.N26(VDD_TOP_3) U1.N28(VDD_TOP_3) U1.N30(VDD_TOP_3) U1.N32(VDD_TOP_3) U1.P6(VDD_TOP_4) U1.P8(VDD_TOP_4) U1.P10(VDD_TOP_4) U1.P12(VDD_TOP_4) U1.P14(VDD_TOP_4) U1.P16(VDD_TOP_4) U1.P18(VDD_TOP_4) U1.P19(VDD_TOP_3) U1.P21(VDD_TOP_3) U1.P23(VDD_TOP_3) U1.P25(VDD_TOP_3) U1.P27(VDD_TOP_3) U1.P29(VDD_TOP_3) U1.P31(VDD_TOP_3) U1.R5(VDD_TOP_4) U1.R7(VDD_TOP_4) U1.R9(VDD_TOP_4) U1.R11(VDD_TOP_4) U1.R13(VDD_TOP_4) U1.R15(VDD_TOP_4) U1.R17(VDD_TOP_4) U1.R20(VDD_TOP_3) U1.R22(VDD_TOP_3) U1.R24(VDD_TOP_3) U1.R26(VDD_TOP_3) U1.R28(VDD_TOP_3) U1.R30(VDD_TOP_3) U1.T6(VDD_TOP_4) U1.T8(VDD_TOP_4) U1.T10(VDD_TOP_4) U1.T12(VDD_TOP_4) U1.T14(VDD_TOP_4) U1.T16(VDD_TOP_4) U1.T18(VDD_TOP_4) U1.T19(VDD_TOP_3) U1.T21(VDD_TOP_3) U1.T23(VDD_TOP_3) U1.T25(VDD_TOP_3) U1.T27(VDD_TOP_3) U1.T29(VDD_TOP_3) U1.T31(VDD_TOP_3) U1.U5(VDD_TOP_4) U1.U7(VDD_TOP_4) U1.U9(VDD_TOP_4) U1.U11(VDD_TOP_4) U1.U13(VDD_TOP_4) U1.U15(VDD_TOP_4) U1.U17(VDD_TOP_4) U1.U20(VDD_TOP_3) U1.U22(VDD_TOP_3) U1.U24(VDD_TOP_3) U1.U26(VDD_TOP_3) U1.U28(VDD_TOP_3) U1.U30(VDD_TOP_3) U1.V4(VDD_TOP_4) U1.V6(VDD_TOP_4) U1.V8(VDD_TOP_4) U1.V10(VDD_TOP_4) U1.V12(VDD_TOP_4) U1.V14(VDD_TOP_4) U1.V16(VDD_TOP_4) U1.V18(VDD_TOP_4) U1.V19(VDD_TOP_3) U1.V21(VDD_TOP_3) U1.V23(VDD_TOP_3) U1.V25(VDD_TOP_3) U1.V27(VDD_TOP_3) U1.V29(VDD_TOP_3) U1.V31(VDD_TOP_3) U1.W6(VDD_TOP_1) U1.W8(VDD_TOP_1) U1.W10(VDD_TOP_1) U1.W12(VDD_TOP_1) U1.W14(VDD_TOP_1) U1.W16(VDD_TOP_1) U1.W18(VDD_TOP_1) U1.W19(VDD_TOP_2) U1.W21(VDD_TOP_2) U1.W23(VDD_TOP_2) U1.W25(VDD_TOP_2) U1.W27(VDD_TOP_2) U1.W29(VDD_TOP_2) U1.W31(VDD_TOP_2) U1.W33(VDD_TOP_2) U1.Y7(VDD_TOP_1) U1.Y9(VDD_TOP_1) U1.Y11(VDD_TOP_1) U1.Y13(VDD_TOP_1) U1.Y15(VDD_TOP_1) U1.Y17(VDD_TOP_1) U1.Y20(VDD_TOP_2) U1.Y22(VDD_TOP_2) U1.Y24(VDD_TOP_2) U1.Y26(VDD_TOP_2) U1.Y28(VDD_TOP_2) U1.Y30(VDD_TOP_2) U1.Y32(VDD_TOP_2)
GND: U1.A1(VSS) U1.A2(VSS) U1.A10(VSS) U1.A12(VSS) U1.A19(VSS) U1.A29(VSS) U1.A35(VSS) U1.A36(VSS) U1.AA3(VSS) U1.AA5(VSS) U1.AA7(VSS) U1.AA9(VSS) U1.AA11(VSS) U1.AA13(VSS) U1.AA15(VSS) U1.AA17(VSS) U1.AA20(VSS) U1.AA22(VSS) U1.AA24(VSS) U1.AA26(VSS) U1.AA28(VSS) U1.AA30(VSS) U1.AA32(VSS) U1.AB6(VSS) U1.AB8(VSS) U1.AB10(VSS) U1.AB12(VSS) U1.AB14(VSS) U1.AB16(VSS) U1.AB18(VSS) U1.AB19(VSS) U1.AB21(VSS) U1.AB23(VSS) U1.AB25(VSS) U1.AB27(VSS) U1.AB29(VSS) U1.AB31(VSS) U1.AC5(VSS) U1.AC7(VSS) U1.AC9(VSS) U1.AC11(VSS) U1.AC13(VSS) U1.AC15(VSS) U1.AC17(VSS) U1.AC20(VSS) U1.AC22(VSS) U1.AC24(VSS) U1.AC26(VSS) U1.AC28(VSS) U1.AC30(VSS) U1.AC32(VSS) U1.AC34(VSS) U1.AD4(VSS) U1.AD6(VSS) U1.AD8(VSS) U1.AD10(VSS) U1.AD12(VSS) U1.AD14(VSS) U1.AD16(VSS) U1.AD18(VSS) U1.AD19(VSS) U1.AD21(VSS) U1.AD23(VSS) U1.AD25(VSS) U1.AD27(VSS) U1.AD29(VSS) U1.AD31(VSS) U1.AE1(VSS) U1.AE5(VSS) U1.AE7(VSS) U1.AE9(VSS) U1.AE11(VSS) U1.AE13(VSS) U1.AE15(VSS) U1.AE17(VSS) U1.AE20(VSS) U1.AE22(VSS) U1.AE24(VSS) U1.AE26(VSS) U1.AE28(VSS) U1.AE30(VSS) U1.AE32(VSS) U1.AF8(VSS) U1.AF10(VSS) U1.AF12(VSS) U1.AF14(VSS) U1.AF16(VSS) U1.AF18(VSS) U1.AF19(VSS) U1.AF21(VSS) U1.AF23(VSS) U1.AF25(VSS) U1.AF27(VSS) U1.AF29(VSS) U1.AF31(VSS) U1.AF35(VSS) U1.AG1(VSS) U1.AG5(VSS) U1.AG7(VSS) U1.AG9(VSS) U1.AG11(VSS) U1.AG13(VSS) U1.AG15(VSS) U1.AG17(VSS) U1.AG20(VSS) U1.AG22(VSS) U1.AG24(VSS) U1.AG26(VSS) U1.AG28(VSS) U1.AG30(VSS) U1.AG32(VSS) U1.AH2(VSS) U1.AH6(VSS) U1.AH8(VSS) U1.AH10(VSS) U1.AH12(VSS) U1.AH14(VSS) U1.AH16(VSS) U1.AH18(VSS) U1.AH19(VSS) U1.AH21(VSS) U1.AH23(VSS) U1.AH25(VSS) U1.AH27(VSS) U1.AH29(VSS) U1.AH31(VSS) U1.AJ5(VSS) U1.AJ7(VSS) U1.AJ9(VSS) U1.AJ11(VSS) U1.AJ13(VSS) U1.AJ15(VSS) U1.AJ17(VSS) U1.AJ20(VSS) U1.AJ22(VSS) U1.AJ24(VSS) U1.AJ26(VSS) U1.AJ28(VSS) U1.AJ30(VSS) U1.AJ32(VSS) U1.AJ36(VSS) U1.AK6(VSS) U1.AK8(VSS) U1.AK10(VSS) U1.AK12(VSS) U1.AK14(VSS) U1.AK16(VSS) U1.AK18(VSS) U1.AK19(VSS) U1.AK21(VSS) U1.AK23(VSS) U1.AK25(VSS) U1.AK27(VSS) U1.AK29(VSS) U1.AK31(VSS) U1.AK33(VSS) U1.AL3(VSS) U1.AL5(VSS) U1.AL7(VSS) U1.AL9(VSS) U1.AL11(VSS) U1.AL13(VSS) U1.AL15(VSS) U1.AL17(VSS) U1.AL20(VSS) U1.AL22(VSS) U1.AL24(VSS) U1.AL28(VSS) U1.AL30(VSS) U1.AM8(VSS) U1.AM10(VSS) U1.AM12(VSS) U1.AM14(VSS) U1.AM16(VSS) U1.AM18(VSS) U1.AM20(VSS) U1.AM21(VSS) U1.AM23(VSS) U1.AM25(VSS) U1.AM27(VSS) U1.AM29(VSS) U1.AM31(VSS) U1.AM35(VSS) U1.AN7(VSS) U1.AN17(VSS) U1.AN24(VSS) U1.AN34(VSS) U1.AP4(VSS) U1.AP14(VSS) U1.AP18(VSS) U1.AP21(VSS) U1.AP31(VSS) U1.AR1(VSS) U1.AR5(VSS) U1.AR11(VSS) U1.AR28(VSS) U1.AR36(VSS) U1.AT1(VSS) U1.AT2(VSS) U1.AT8(VSS) U1.AT18(VSS) U1.AT25(VSS) U1.AT27(VSS) U1.AT35(VSS) U1.AT36(VSS) U1.B1(VSS) U1.B9(VSS) U1.B26(VSS) U1.B32(VSS) U1.B36(VSS) U1.C6(VSS) U1.C16(VSS) U1.C19(VSS) U1.C23(VSS) U1.C33(VSS) U1.D3(VSS) U1.D13(VSS) U1.D20(VSS) U1.D30(VSS) U1.E2(VSS) U1.E6(VSS) U1.E8(VSS) U1.E10(VSS) U1.E12(VSS) U1.E14(VSS) U1.E16(VSS) U1.E17(VSS) U1.E19(VSS) U1.E21(VSS) U1.E23(VSS) U1.E25(VSS) U1.E27(VSS) U1.E29(VSS) U1.F7(VSS) U1.F9(VSS) U1.F13(VSS) U1.F15(VSS) U1.F17(VSS) U1.F20(VSS) U1.F22(VSS) U1.F24(VSS) U1.F26(VSS) U1.F28(VSS) U1.F30(VSS) U1.F32(VSS) U1.F34(VSS) U1.G4(VSS) U1.G6(VSS) U1.G8(VSS) U1.G10(VSS) U1.G12(VSS) U1.G14(VSS) U1.G16(VSS) U1.G18(VSS) U1.G19(VSS) U1.G21(VSS) U1.G23(VSS) U1.G25(VSS) U1.G27(VSS) U1.G29(VSS) U1.G31(VSS) U1.H1(VSS) U1.H5(VSS) U1.H7(VSS) U1.H9(VSS) U1.H11(VSS) U1.H13(VSS) U1.H15(VSS) U1.H17(VSS) U1.H20(VSS) U1.H22(VSS) U1.H24(VSS) U1.H26(VSS) U1.H28(VSS) U1.H30(VSS) U1.H32(VSS) U1.J6(VSS) U1.J8(VSS) U1.J10(VSS) U1.J12(VSS) U1.J14(VSS) U1.J16(VSS) U1.J18(VSS) U1.J19(VSS) U1.J21(VSS) U1.J23(VSS) U1.J25(VSS) U1.J27(VSS) U1.J29(VSS) U1.J31(VSS) U1.J35(VSS) U1.K5(VSS) U1.K7(VSS) U1.K9(VSS) U1.K11(VSS) U1.K13(VSS) U1.K15(VSS) U1.K17(VSS) U1.K20(VSS) U1.K22(VSS) U1.K24(VSS) U1.K26(VSS) U1.K28(VSS) U1.K30(VSS) U1.K32(VSS) U1.K36(VSS) U1.L2(VSS) U1.L6(VSS) U1.L8(VSS) U1.L10(VSS) U1.L12(VSS) U1.L14(VSS) U1.L16(VSS) U1.L18(VSS) U1.L19(VSS) U1.L21(VSS) U1.L23(VSS) U1.L25(VSS) U1.L27(VSS) U1.L29(VSS) U1.M5(VSS) U1.M7(VSS) U1.M9(VSS) U1.M11(VSS) U1.M13(VSS) U1.M15(VSS) U1.M17(VSS) U1.M20(VSS) U1.M22(VSS) U1.M24(VSS) U1.M26(VSS) U1.M28(VSS) U1.M30(VSS) U1.M32(VSS) U1.M36(VSS) U1.N6(VSS) U1.N8(VSS) U1.N10(VSS) U1.N12(VSS) U1.N14(VSS) U1.N16(VSS) U1.N18(VSS) U1.N19(VSS) U1.N21(VSS) U1.N23(VSS) U1.N25(VSS) U1.N27(VSS) U1.N29(VSS) U1.N31(VSS) U1.N33(VSS) U1.P3(VSS) U1.P5(VSS) U1.P7(VSS) U1.P9(VSS) U1.P11(VSS) U1.P13(VSS) U1.P15(VSS) U1.P17(VSS) U1.P20(VSS) U1.P22(VSS) U1.P24(VSS) U1.P26(VSS) U1.P28(VSS) U1.P30(VSS) U1.P32(VSS) U1.R6(VSS) U1.R8(VSS) U1.R10(VSS) U1.R12(VSS) U1.R14(VSS) U1.R16(VSS) U1.R18(VSS) U1.R19(VSS) U1.R21(VSS) U1.R23(VSS) U1.R25(VSS) U1.R27(VSS) U1.R29(VSS) U1.R31(VSS) U1.T5(VSS) U1.T7(VSS) U1.T9(VSS) U1.T11(VSS) U1.T13(VSS) U1.T15(VSS) U1.T17(VSS) U1.T20(VSS) U1.T22(VSS) U1.T24(VSS) U1.T26(VSS) U1.T28(VSS) U1.T30(VSS) U1.T32(VSS) U1.T34(VSS) U1.U4(VSS) U1.U6(VSS) U1.U8(VSS) U1.U10(VSS) U1.U12(VSS) U1.U14(VSS) U1.U16(VSS) U1.U18(VSS) U1.U19(VSS) U1.U21(VSS) U1.U23(VSS) U1.U25(VSS) U1.U27(VSS) U1.U29(VSS) U1.U31(VSS) U1.U32(VSS) U1.V1(VSS) U1.V3(VSS) U1.V5(VSS) U1.V7(VSS) U1.V9(VSS) U1.V11(VSS) U1.V13(VSS) U1.V15(VSS) U1.V17(VSS) U1.V20(VSS) U1.V22(VSS) U1.V24(VSS) U1.V26(VSS) U1.V28(VSS) U1.V30(VSS) U1.W7(VSS) U1.W9(VSS) U1.W11(VSS) U1.W13(VSS) U1.W15(VSS) U1.W17(VSS) U1.W20(VSS) U1.W22(VSS) U1.W24(VSS) U1.W26(VSS) U1.W28(VSS) U1.W30(VSS) U1.W32(VSS) U1.W34(VSS) U1.W36(VSS) U1.Y5(VSS) U1.Y6(VSS) U1.Y8(VSS) U1.Y10(VSS) U1.Y12(VSS) U1.Y14(VSS) U1.Y16(VSS) U1.Y18(VSS) U1.Y19(VSS) U1.Y21(VSS) U1.Y23(VSS) U1.Y25(VSS) U1.Y27(VSS) U1.Y29(VSS) U1.Y31(VSS) U1.Y33(VSS)

### Notes on the sheet
- Block Name
- Document Type: Schematic
- Size
- File Name
- Variant
- Rev.
- Project Name
- Sheet
- /